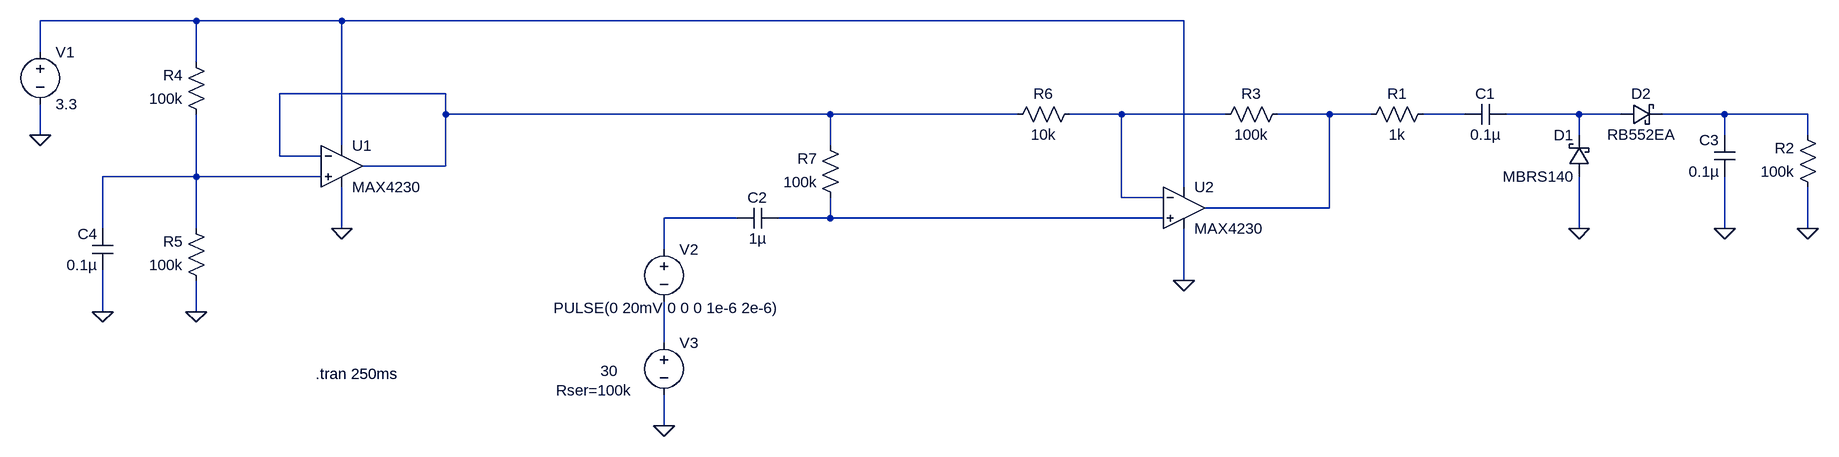
[diagram p0: schematic opamp.asc]
opamp.asc, the LTspice schematic file:
Version 4
SHEET 1 1220 680
WIRE -1280 -112 -1520 -112
WIRE -1056 -112 -1280 -112
WIRE 240 -112 -1056 -112
WIRE -1520 -64 -1520 -112
WIRE -1280 -48 -1280 -112
WIRE -896 0 -1152 0
WIRE -896 32 -896 0
WIRE -304 32 -896 32
WIRE -16 32 -304 32
WIRE 144 32 64 32
WIRE 304 32 144 32
WIRE 464 32 384 32
WIRE 528 32 464 32
WIRE 672 32 608 32
WIRE 848 32 736 32
WIRE 912 32 848 32
WIRE 1072 32 976 32
WIRE 1200 32 1072 32
WIRE -1520 64 -1520 16
WIRE 848 64 848 32
WIRE 1072 64 1072 32
WIRE 1200 64 1200 32
WIRE -1056 80 -1056 -112
WIRE -304 80 -304 32
WIRE -1152 96 -1152 0
WIRE -1088 96 -1152 96
WIRE -896 112 -896 32
WIRE -896 112 -1024 112
WIRE -1280 128 -1280 32
WIRE -1280 128 -1424 128
WIRE -1088 128 -1280 128
WIRE 240 144 240 -112
WIRE 144 160 144 32
WIRE 208 160 144 160
WIRE 464 176 464 32
WIRE 464 176 272 176
WIRE -448 192 -560 192
WIRE -304 192 -304 160
WIRE -304 192 -384 192
WIRE 208 192 -304 192
WIRE -1424 208 -1424 128
WIRE -1280 208 -1280 128
WIRE -1056 208 -1056 144
WIRE 848 208 848 128
WIRE 1072 208 1072 128
WIRE 1200 208 1200 144
WIRE -560 240 -560 192
WIRE 240 288 240 208
WIRE -1424 336 -1424 272
WIRE -1280 336 -1280 288
WIRE -560 384 -560 320
WIRE -560 512 -560 464
FLAG -1520 64 0
FLAG -1280 336 0
FLAG -1056 208 0
FLAG -560 512 0
FLAG 240 288 0
FLAG 848 208 0
FLAG 1072 208 0
FLAG 1200 208 0
FLAG -1424 336 0
SYMBOL voltage -1520 -80 R0
WINDOW 123 0 0 Left 0
WINDOW 39 0 0 Left 0
SYMATTR InstName V1
SYMATTR Value 3.3
SYMBOL voltage -560 224 R0
WINDOW 3 -170 106 Left 2
WINDOW 123 0 0 Left 0
WINDOW 39 -170 134 Left 2
SYMATTR Value PULSE(0 20mV 0 0 0 1e-6 2e-6)
SYMATTR InstName V2
SYMBOL cap -384 176 R90
WINDOW 0 0 32 VBottom 2
WINDOW 3 32 32 VTop 2
SYMATTR InstName C2
SYMATTR Value 1µ
SYMBOL res 400 16 R90
WINDOW 0 0 56 VBottom 2
WINDOW 3 32 56 VTop 2
SYMATTR InstName R3
SYMATTR Value 100k
SYMBOL OpAmps\\MAX4230 240 112 R0
SYMATTR InstName U2
SYMBOL OpAmps\\MAX4230 -1056 48 R0
SYMATTR InstName U1
SYMBOL res -1264 48 R180
WINDOW 0 36 76 Left 2
WINDOW 3 36 40 Left 2
SYMATTR InstName R4
SYMATTR Value 100k
SYMBOL res -1264 304 R180
WINDOW 0 36 76 Left 2
WINDOW 3 36 40 Left 2
SYMATTR InstName R5
SYMATTR Value 100k
SYMBOL res -32 48 R270
WINDOW 0 32 56 VTop 2
WINDOW 3 0 56 VBottom 2
SYMATTR InstName R6
SYMATTR Value 10k
SYMBOL res -288 176 R180
WINDOW 0 36 76 Left 2
WINDOW 3 36 40 Left 2
SYMATTR InstName R7
SYMATTR Value 100k
SYMBOL res 512 48 R270
WINDOW 0 32 56 VTop 2
WINDOW 3 0 56 VBottom 2
SYMATTR InstName R1
SYMATTR Value 1k
SYMBOL cap 736 16 R90
WINDOW 0 0 32 VBottom 2
WINDOW 3 32 32 VTop 2
SYMATTR InstName C1
SYMATTR Value 0.1µ
SYMBOL cap 1088 128 R180
WINDOW 0 24 56 Left 2
WINDOW 3 24 8 Left 2
SYMATTR InstName C3
SYMATTR Value 0.1µ
SYMBOL res 1216 160 R180
WINDOW 0 36 76 Left 2
WINDOW 3 36 40 Left 2
SYMATTR InstName R2
SYMATTR Value 100k
SYMBOL schottky 864 128 R180
WINDOW 0 24 64 Left 2
WINDOW 3 24 0 Left 2
SYMATTR InstName D1
SYMATTR Value MBRS140
SYMATTR Description Diode
SYMATTR Type diode
SYMBOL schottky 912 48 R270
WINDOW 0 32 32 VTop 2
WINDOW 3 0 32 VBottom 2
SYMATTR InstName D2
SYMATTR Value RB552EA
SYMATTR Description Diode
SYMATTR Type diode
SYMBOL cap -1408 272 R180
WINDOW 0 24 56 Left 2
WINDOW 3 24 8 Left 2
SYMATTR InstName C4
SYMATTR Value 0.1µ
SYMBOL voltage -560 368 R0
WINDOW 3 -98 59 Left 2
WINDOW 123 0 0 Left 0
WINDOW 39 -166 89 Left 2
SYMATTR Value 30
SYMATTR SpiceLine Rser=100k
SYMATTR InstName V3
TEXT -1096 432 Left 2 !.tran 250ms

The netlist it stands for:
* opamp.asc
V1 N001 0 3.3
V2 N009 N011 PULSE(0 20mV 0 0 0 1e-6 2e-6)
C2 N010 N009 1µ
R3 N004 N003 100k
XU2 N010 N003 N001 0 N004 MAX4230  ; pins In+ In- V+ V- OUT
XU1 N008 N002 N001 0 N002 MAX4230  ; pins In+ In- V+ V- OUT
R4 N008 N001 100k
R5 0 N008 100k
R6 N002 N003 10k
R7 N010 N002 100k
R1 N004 N005 1k
C1 N006 N005 0.1µ
C3 0 N007 0.1µ
R2 0 N007 100k
D1 0 N006 MBRS140
D2 N006 N007 RB552EA
C4 0 N008 0.1µ
V3 N011 0 30 Rser=100k
.model D D
.lib standard.dio
.tran 250ms
.lib MAX4230.lib
.backanno
.end